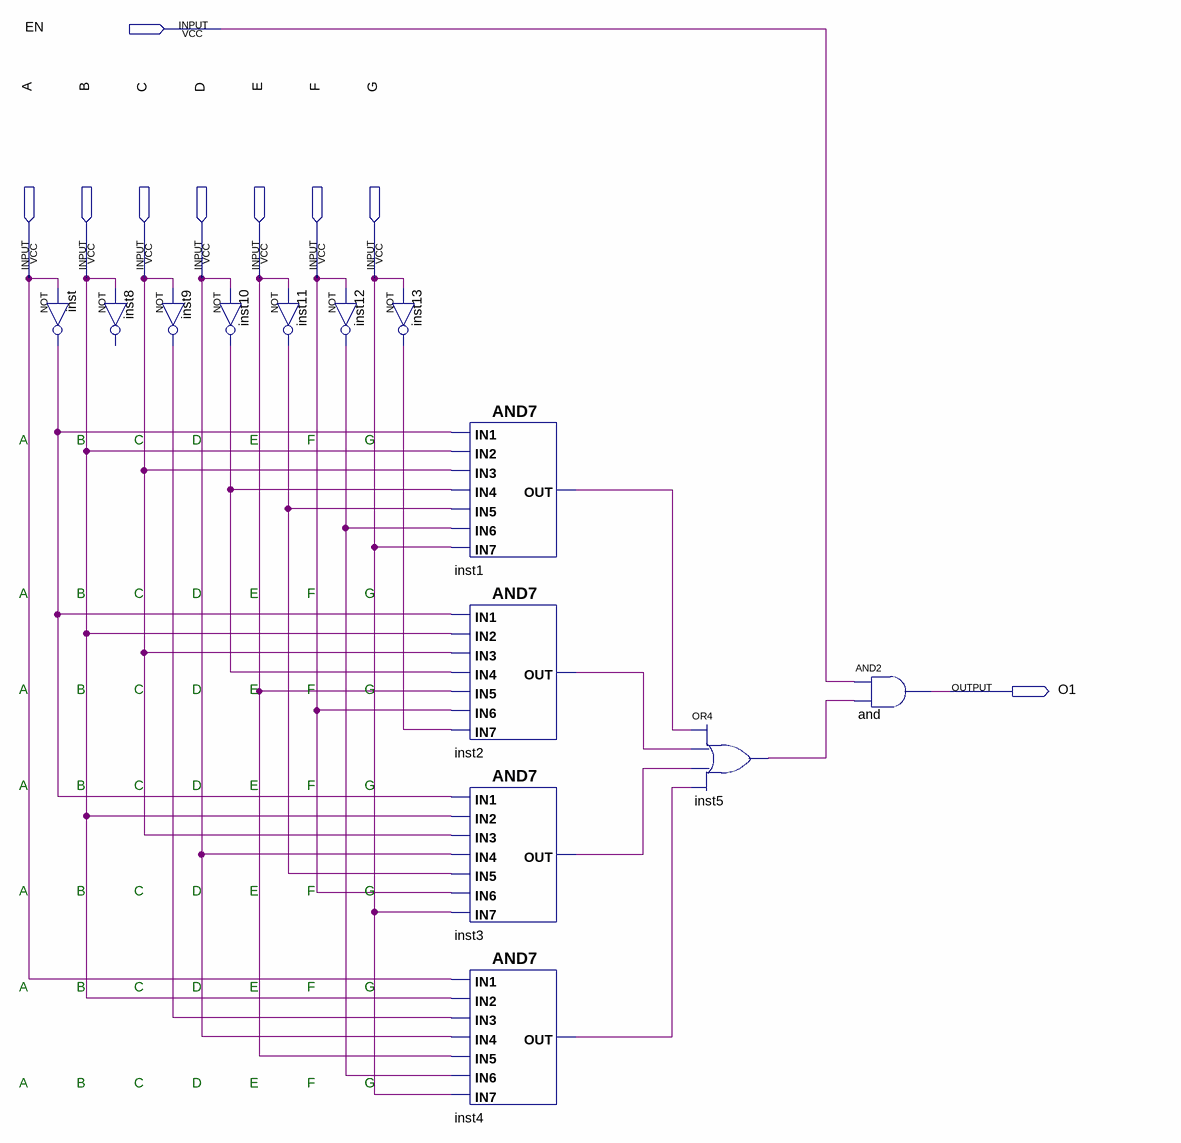
[diagram p0: schematic sheet]
// Quartus schematic linha2led2.bdf as structural Verilog: 13 symbols, 9 pins
module linha2led2 (
  input  EN,
  input  A,
  input  B,
  input  C,
  input  D,
  input  E,
  input  F,
  input  G,
  output O1
);

  wire inst1_out, inst2_out, inst3_out, inst4_out, inst5_out, inst9_out, inst10_out, inst11_out, inst12_out,
       inst13_out, inst_out;

  not inst (inst_out, A);
  // NOT inst8 has open pins: IN=B, OUT=open
  not inst9 (inst9_out, C);
  not inst10 (inst10_out, D);
  not inst11 (inst11_out, E);
  not inst12 (inst12_out, F);
  not inst13 (inst13_out, G);
  and inst1 (inst1_out, inst_out, B, C, inst10_out, inst11_out, inst12_out, G);
  and inst2 (inst2_out, inst_out, B, C, inst10_out, E, F, inst13_out);
  and inst3 (inst3_out, inst_out, B, C, D, inst11_out, F, G);
  and inst4 (inst4_out, A, B, inst9_out, D, E, inst12_out, G);
  or inst5 (inst5_out, inst1_out, inst2_out, inst3_out, inst4_out);
  and \and  (O1, EN, inst5_out);

  // Notes on the sheet:
  //   A
  //   B
  //   C
  //   D
  //   E
  //   F
  //   G
  //   A
  //   B
  //   C
  //   D
  //   E
  //   F
  //   G
  //   A
  //   B
  //   C
  //   D
  //   E
  //   F
  //   G
  //   A
  //   B
  //   C
  //   D
  //   E
  //   F
  //   G
  //   A
  //   B
  //   C
  //   D
  //   E
  //   F
  //   G
  //   A
  //   B
  //   C
  //   D
  //   E
  //   F
  //   G
  //   A
  //   B
  //   C
  //   D
  //   E
  //   F
  //   G
endmodule
